# Altium schematic sheet GalvoPrint.SchDoc
size A2
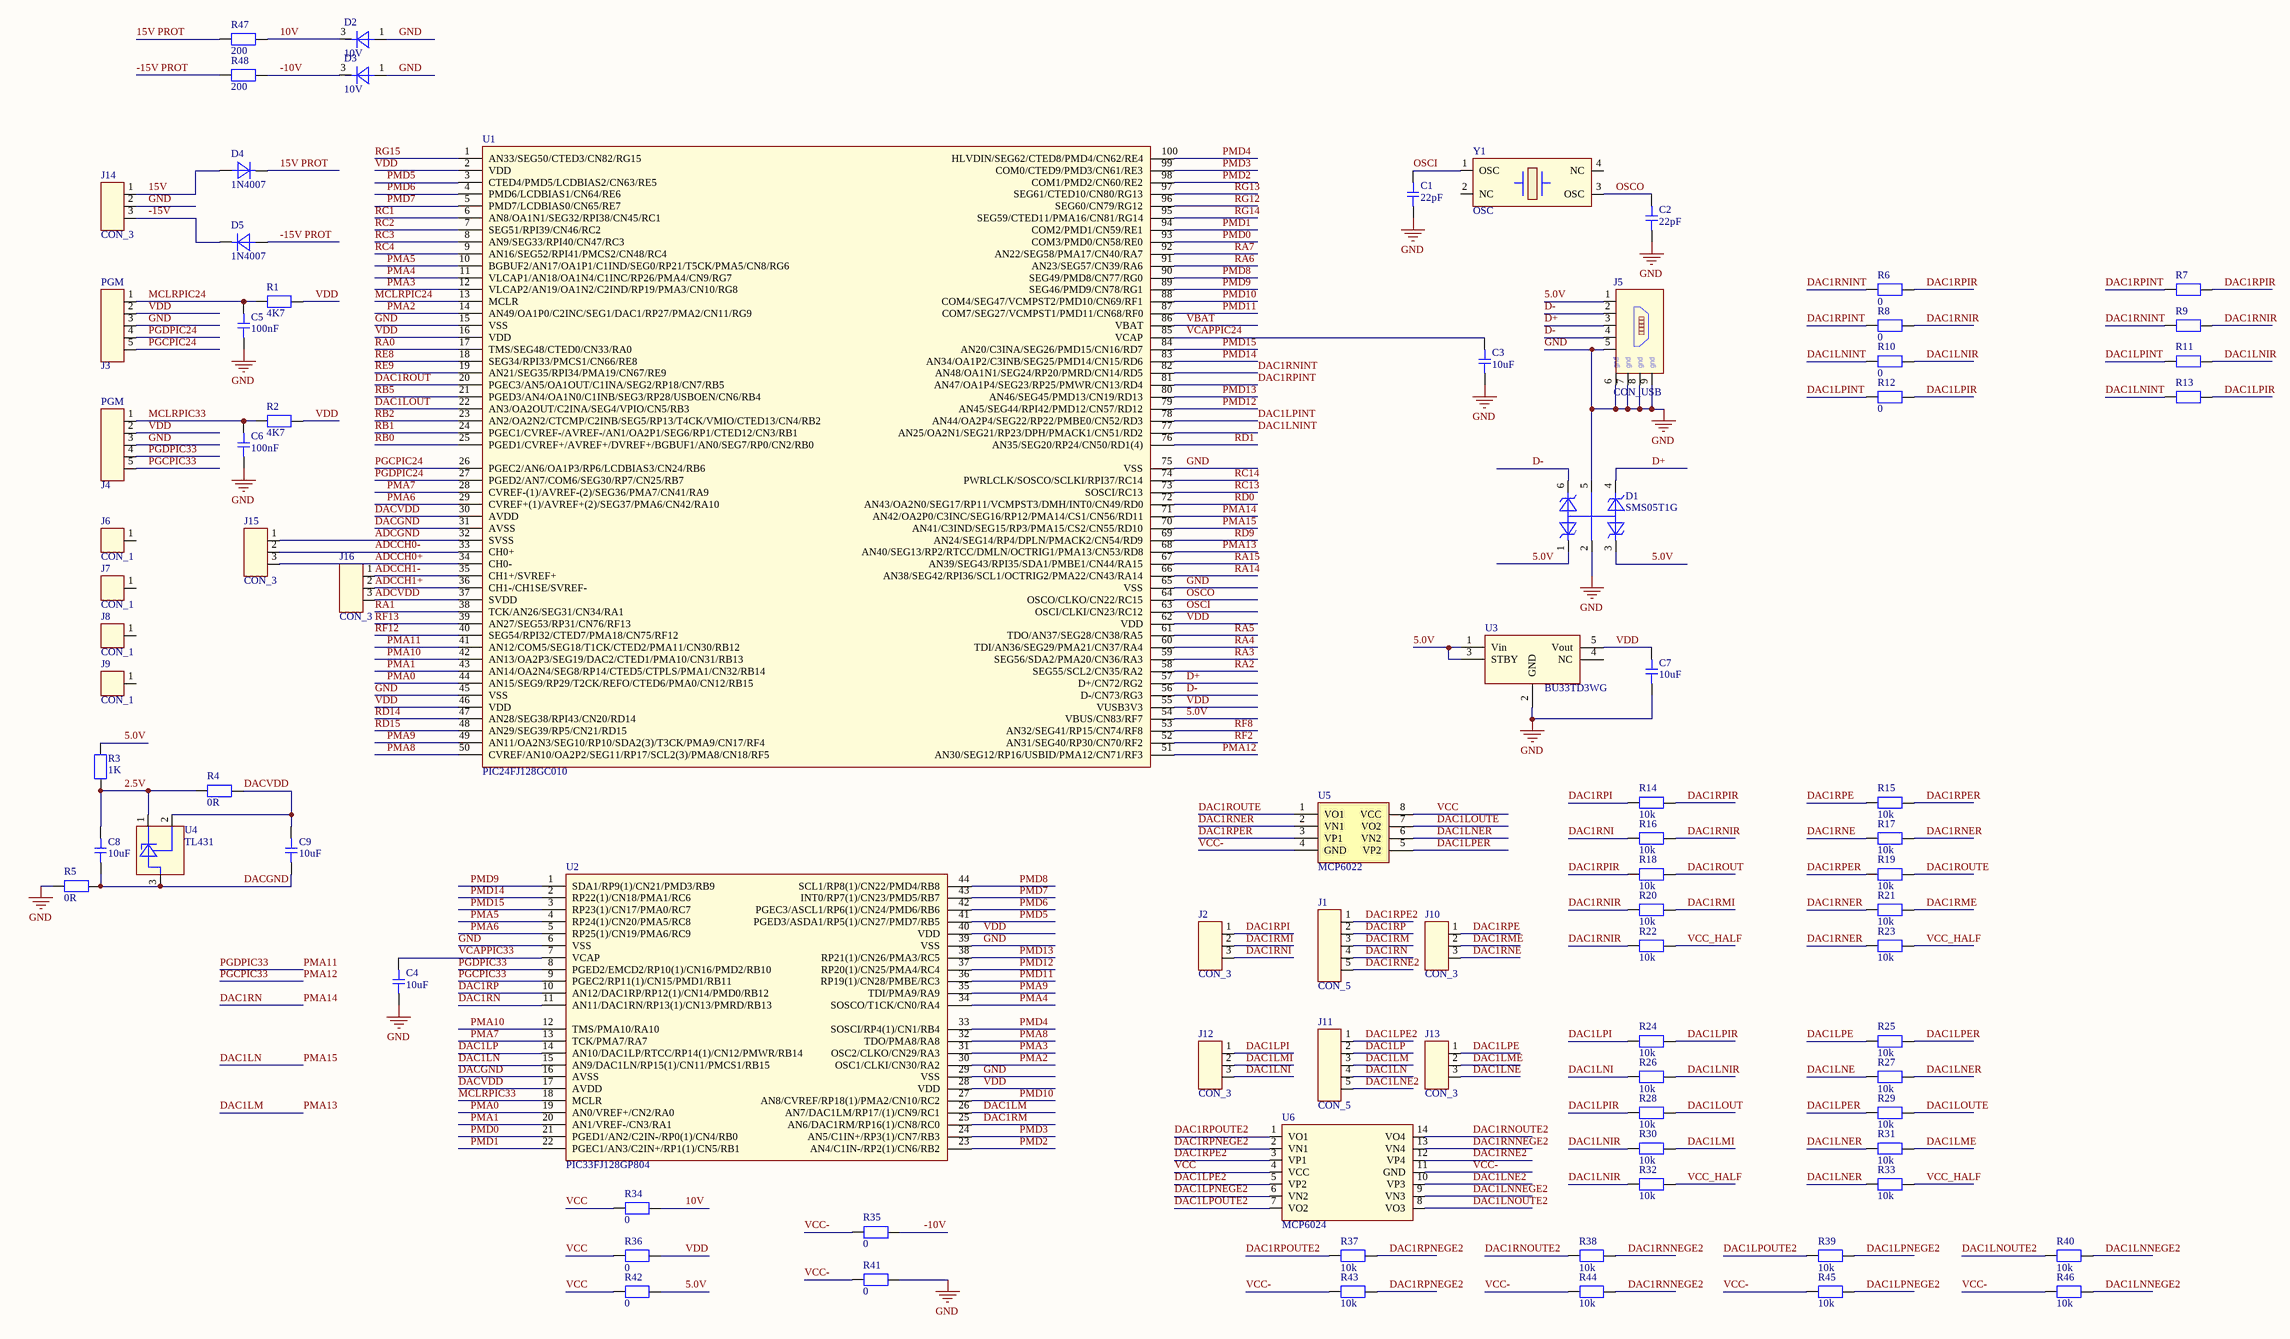
[diagram p0: GalvoPrint.SchDoc]

## Parts
C1  value 22pF  [0603_C]  (hidden comment: C)
C2  value 22pF  [0603_C]  (hidden comment: C)
C3  value 10uF  [0603_C]  (hidden comment: C)
C4  value 10uF  [0603_C]  (hidden comment: C)
C5  value 100nF  [0603_C]  (hidden comment: C)
C6  value 100nF  [0603_C]  (hidden comment: C)
C7  value 10uF  [0603_C]  (hidden comment: C)
C8  value 10uF  [0603_C]  (hidden comment: C)
C9  value 10uF  [0603_C]  (hidden comment: C)
D1  SMS05T1G  [SOT23_6]
D2  10V  [SOT23_3]
D3  10V  [SOT23_3]
D4  1N4007  [SMA]
D5  1N4007  [SMA]
J1  CON_5  [HDR_254_5]
J2  CON_3  [HDR_254_3]
J3  value PGM  [HDR_254_5]  (hidden comment: CON_5)
J4  value PGM  [HDR_254_5]  (hidden comment: CON_5)
J5  CON_USB  [CON_USB_MINI]
J6  CON_1  [MOUNT_HOLE]
J7  CON_1  [MOUNT_HOLE]
J8  CON_1  [MOUNT_HOLE]
J9  CON_1  [MOUNT_HOLE]
J10  CON_3  [HDR_254_3]
J11  CON_5  [HDR_254_5]
J12  CON_3  [HDR_254_3]
J13  CON_3  [HDR_254_3]
J14  CON_3  [HDR_500_3]
J15  CON_3  [HDR_254_3]
J16  CON_3  [HDR_254_3]
R1  value 4K7  [0603_R]  (hidden comment: R)
R2  value 4K7  [0603_R]  (hidden comment: R)
R3  value 1K  [0603_R]  (hidden comment: R)
R4  value 0R  [0603_R]  (hidden comment: R)
R5  value 0R  [0603_R]  (hidden comment: R)
R6  0  [0603_R]
R7  (no value)  [0603_R]
R8  0  [0603_R]
R9  (no value)  [0603_R]
R10  0  [0603_R]
R11  (no value)  [0603_R]
R12  0  [0603_R]
R13  (no value)  [0603_R]
R14  10k  [0603_R]
R15  10k  [0603_R]
R16  10k  [0603_R]
R17  10k  [0603_R]
R18  10k  [0603_R]
R19  10k  [0603_R]
R20  10k  [0603_R]
R21  10k  [0603_R]
R22  10k  [0603_R]
R23  10k  [0603_R]
R24  10k  [0603_R]
R25  10k  [0603_R]
R26  10k  [0603_R]
R27  10k  [0603_R]
R28  10k  [0603_R]
R29  10k  [0603_R]
R30  10k  [0603_R]
R31  10k  [0603_R]
R32  10k  [0603_R]
R33  10k  [0603_R]
R34  0  [0603_R]
R35  0  [0603_R]
R36  0  [0603_R]
R37  10k  [0603_R]
R38  10k  [0603_R]
R39  10k  [0603_R]
R40  10k  [0603_R]
R41  0  [0603_R]
R42  0  [0603_R]
R43  10k  [0603_R]
R44  10k  [0603_R]
R45  10k  [0603_R]
R46  10k  [0603_R]
R47  value 200  [0603_R]  (hidden comment: R)
R48  value 200  [0603_R]  (hidden comment: R)
U1  value PIC24FJ128GC010  [TQFP_100]  (hidden comment: IC_PIC24FJ128GC010)
U2  value PIC33FJ128GP804  [TQFP_44]  (hidden comment: IC_PIC33FJ128GP804)
U3  BU33TD3WG  [SOT23_5]
U4  value TL431  [SOT23_3]  (hidden comment: IC_TL431_SOT23_3)
U5  MCP6022  [SOIC_8]
U6  MCP6024  [SOIC_14]
Y1  value OSC  [OSC_DFN_2x2.5mm]  (hidden comment: XTAL_OSC1OSC3)

## Nets
GND: C1.1 C2.1 C3.1 C4.1 C5.1 C6.1 C7.1 D1.2(AAAA) D1.5(C4) D2.1(A) D3.1(A) J3.3 J4.3 J5.5 J5.6 J5.7 J5.8 J5.9 J14.2 R5.1 R41.2 U1.15(VSS) U1.45(VSS) U1.65(VSS) U1.75(VSS) U2.6(VSS) U2.29(VSS) U2.39(VSS) U3.2(GND)
2.5V: C8.2 R3.1 R4.1 U4.1(Cathode)
5.0V: D1.1(C1) D1.3(C2) J5.1 R3.2 R42.2 U1.54(VBUS/CN83/RF7) U3.1(Vin) U3.3(STBY)
10V: D2.3(C) R34.2 R47.2
15V: D4.2(A) J14.1
15V PROT: D4.1(C) R47.1
-10V: D3.3(C) R35.2 R48.2
-15V: D5.1(C) J14.3
-15V PROT: D5.2(A) R48.1
ADCCH0+: J15.3 U1.34(CH0-)
ADCCH0-: J15.2 U1.33(CH0+)
ADCCH1+: J16.2 U1.36(CH1-/CH1SE/SVREF-)
ADCCH1-: J16.1 U1.35(CH1+/SVREF+)
ADCGND: J15.1 U1.32(SVSS)
ADCVDD: J16.3 U1.37(SVDD)
D+: D1.4(C3) J5.3 U1.57(D+/CN72/RG2)
D-: D1.6(C4) J5.2 J5.4 U1.56(D-/CN73/RG3)
DAC1LM: J11.3 U1.68(AN40/SEG13/RP2/RTCC/DMLN/OCTRIG1/PMA13/CN53/RD8) U2.26(AN7/DAC1LM/RP17/(1)/CN9/RC1)  [also labelled PMA13]
DAC1LME: J13.2 R31.2
DAC1LMI: J12.2 R30.2
DAC1LN: J11.4 U1.70(AN41/C3IND/SEG15/RP3/PMA15/CS2/CN55/RD10) U2.15(AN9/DAC1LN/RP15(1)/CN11/PMCS1/RB15)  [also labelled PMA15]
DAC1LNE: J13.3 R27.1
DAC1LNE2: J11.5 U6.10(VP3)
DAC1LNER: R27.2 R31.1 R33.1 U5.6(VN2)
DAC1LNI: J12.3 R26.1
DAC1LNINT: R10.1 R13.1 U1.77(AN25/OA2N1/SEG21/RP23/DPH/PMACK1/CN51/RD2)
DAC1LNIR: R10.2 R11.2 R26.2 R30.1 R32.1
DAC1LNNEGE2: R40.2 R46.2 U6.9(VN3)
DAC1LNOUTE2: R40.1 U6.8(VO3)
DAC1LOUT: R28.2 U1.22(AN3/OA2OUT/C2INA/SEG4/VPIO/CN5/RB3)
DAC1LOUTE: R29.2 U5.7(VO2)
DAC1LP: J11.2 U2.14(AN10/DAC1LP/RTCC/RP14(1)/CN12/PMWR/RB14)
DAC1LPE: J13.1 R25.1
DAC1LPE2: J11.1 U6.5(VP2)
DAC1LPER: R25.2 R29.1 U5.5(VP2)
DAC1LPI: J12.1 R24.1
DAC1LPINT: R11.1 R12.1 U1.78(AN44/OA2P4/SEG22/RP22/PMBE0/CN52/RD3)
DAC1LPIR: R12.2 R13.2 R24.2 R28.1
DAC1LPNEGE2: R39.2 R45.2 U6.6(VN2)
DAC1LPOUTE2: R39.1 U6.7(VO2)
DAC1RM: J1.3 U2.25(AN6/DAC1RM/RP16(1)/CN8/RC0)
DAC1RME: J10.2 R21.2
DAC1RMI: J2.2 R20.2
DAC1RN: J1.4 U1.71(AN42/OA2P0/C3INC/SEG16/RP12/PMA14/CS1/CN56/RD11) U2.11(AN11/DAC1RN/RP13(1)/CN13/PMRD/RB13)  [also labelled PMA14]
DAC1RNE: J10.3 R17.1
DAC1RNE2: J1.5 U6.12(VP4)
DAC1RNER: R17.2 R21.1 R23.1 U5.2(VN1)
DAC1RNI: J2.3 R16.1
DAC1RNINT: R6.1 R9.1 U1.82(AN48/OA1N1/SEG24/RP20/PMRD/CN14/RD5)
DAC1RNIR: R8.2 R9.2 R16.2 R20.1 R22.1
DAC1RNNEGE2: R38.2 R44.2 U6.13(VN4)
DAC1RNOUTE2: R38.1 U6.14(VO4)
DAC1ROUT: R18.2 U1.20(PGEC3/AN5/OA1OUT/C1INA/SEG2/RP18/CN7/RB5)
DAC1ROUTE: R19.2 U5.1(VO1)
DAC1RP: J1.2 U2.10(AN12/DAC1RP/RP12(1)/CN14/PMD0/RB12)
DAC1RPE: J10.1 R15.1
DAC1RPE2: J1.1 U6.3(VP1)
DAC1RPER: R15.2 R19.1 U5.3(VP1)
DAC1RPI: J2.1 R14.1
DAC1RPINT: R7.1 R8.1 U1.81(AN47/OA1P4/SEG23/RP25/PMWR/CN13/RD4)
DAC1RPIR: R6.2 R7.2 R14.2 R18.1
DAC1RPNEGE2: R37.2 R43.2 U6.2(VN1)
DAC1RPOUTE2: R37.1 U6.1(VO1)
DACGND: C8.1 C9.1 R5.2 U1.31(AVSS) U2.16(AVSS) U4.3(Anode)
DACVDD: C9.2 R4.2 U1.30(AVDD) U2.17(AVDD) U4.2(Ref)
MCLRPIC24: C5.2 J3.1 R1.1 U1.13(MCLR)
MCLRPIC33: C6.2 J4.1 R2.1 U2.18(MCLR)
OSCI: C1.2 U1.63(OSCI/CLKI/CN23/RC12) Y1.1(OSC)
OSCO: C2.2 U1.64(OSCO/CLKO/CN22/RC15) Y1.3(OSC)
PGCPIC24: J3.5 U1.26(PGEC2/AN6/OA1P3/RP6/LCDBIAS3/CN24/RB6)
PGCPIC33: J4.5 U1.51(AN30/SEG12/RP16/USBID/PMA12/CN71/RF3) U2.9(PGEC2/RP11(1)/CN15/PMD1/RB11)  [also labelled PMA12]
PGDPIC24: J3.4 U1.27(PGED2/AN7/COM6/SEG30/RP7/CN25/RB7)
PGDPIC33: J4.4 U1.41(AN12/COM5/SEG18/T1CK/CTED2/PMA11/CN30/RB12) U2.8(PGED2/EMCD2/RP10(1)/CN16/PMD2/RB10)  [also labelled PMA11]
PMA0: U1.44(AN15/SEG9/RP29/T2CK/REFO/CTED6/PMA0/CN12/RB15) U2.19(AN0/VREF+/CN2/RA0)
PMA1: U1.43(AN14/OA2N4/SEG8/RP14/CTED5/CTPLS/PMA1/CN32/RB14) U2.20(AN1/VREF-/CN3/RA1)
PMA2: U1.14(AN49/OA1P0/C2INC/SEG1/DAC1/RP27/PMA2/CN11/RG9) U2.30(OSC1/CLKI/CN30/RA2)
PMA3: U1.12(VLCAP2/AN19/OA1N2/C2IND/RP19/PMA3/CN10/RG8) U2.31(OSC2/CLKO/CN29/RA3)
PMA4: U1.11(VLCAP1/AN18/OA1N4/C1INC/RP26/PMA4/CN9/RG7) U2.34(SOSCO/T1CK/CN0/RA4)
PMA5: U1.10(BGBUF2/AN17/OA1P1/C1IND/SEG0/RP21/T5CK/PMA5/CN8/RG6) U2.4(RP24(1)/CN20/PMA5/RC8)
PMA6: U1.29(CVREF+(1)/AVREF+(2)/SEG37/PMA6/CN42/RA10) U2.5(RP25(1)/CN19/PMA6/RC9)
PMA7: U1.28(CVREF-(1)/AVREF-(2)/SEG36/PMA7/CN41/RA9) U2.13(TCK/PMA7/RA7)
PMA8: U1.50(CVREF/AN10/OA2P2/SEG11/RP17/SCL2(3)/PMA8/CN18/RF5) U2.32(TDO/PMA8/RA8)
PMA9: U1.49(AN11/OA2N3/SEG10/RP10/SDA2(3)/T3CK/PMA9/CN17/RF4) U2.35(TDI/PMA9/RA9)
PMA10: U1.42(AN13/OA2P3/SEG19/DAC2/CTED1/PMA10/CN31/RB13) U2.12(TMS/PMA10/RA10)
PMD0: U1.93(COM3/PMD0/CN58/RE0) U2.21(PGED1/AN2/C2IN-/RP0(1)/CN4/RB0)
PMD1: U1.94(COM2/PMD1/CN59/RE1) U2.22(PGEC1/AN3/C2IN+/RP1(1)/CN5/RB1)
PMD2: U1.98(COM1/PMD2/CN60/RE2) U2.23(AN4/C1IN-/RP2(1)/CN6/RB2)
PMD3: U1.99(COM0/CTED9/PMD3/CN61/RE3) U2.24(AN5/C1IN+/RP3(1)/CN7/RB3)
PMD4: U1.100(HLVDIN/SEG62/CTED8/PMD4/CN62/RE4) U2.33(SOSCI/RP4(1)/CN1/RB4)
PMD5: U1.3(CTED4/PMD5/LCDBIAS2/CN63/RE5) U2.41(PGED3/ASDA1/RP5(1)/CN27/PMD7/RB5)
PMD6: U1.4(PMD6/LCDBIAS1/CN64/RE6) U2.42(PGEC3/ASCL1/RP6(1)/CN24/PMD6/RB6)
PMD7: U1.5(PMD7/LCDBIAS0/CN65/RE7) U2.43(INT0/RP7(1)/CN23/PMD5/RB7)
PMD8: U1.90(SEG49/PMD8/CN77/RG0) U2.44(SCL1/RP8(1)/CN22/PMD4/RB8)
PMD9: U1.89(SEG46/PMD9/CN78/RG1) U2.1(SDA1/RP9(1)/CN21/PMD3/RB9)
PMD10: U1.88(COM4/SEG47/VCMPST2/PMD10/CN69/RF1) U2.27(AN8/CVREF/RP18(1)/PMA2/CN10/RC2)
PMD11: U1.87(COM7/SEG27/VCMPST1/PMD11/CN68/RF0) U2.36(RP19(1)/CN28/PMBE/RC3)
PMD12: U1.79(AN45/SEG44/RPI42/PMD12/CN57/RD12) U2.37(RP20(1)/CN25/PMA4/RC4)
PMD13: U1.80(AN46/SEG45/PMD13/CN19/RD13) U2.38(RP21(1)/CN26/PMA3/RC5)
PMD14: U1.83(AN34/OA1P2/C3INB/SEG25/PMD14/CN15/RD6) U2.2(RP22(1)/CN18/PMA1/RC6)
PMD15: U1.84(AN20/C3INA/SEG26/PMD15/CN16/RD7) U2.3(RP23(1)/CN17/PMA0/RC7)
RA0: U1.17(TMS/SEG48/CTED0/CN33/RA0)
RA1: U1.38(TCK/AN26/SEG31/CN34/RA1)
RA2: U1.58(SEG55/SCL2/CN35/RA2)
RA3: U1.59(SEG56/SDA2/PMA20/CN36/RA3)
RA4: U1.60(TDI/AN36/SEG29/PMA21/CN37/RA4)
RA5: U1.61(TDO/AN37/SEG28/CN38/RA5)
RA6: U1.91(AN23/SEG57/CN39/RA6)
RA7: U1.92(AN22/SEG58/PMA17/CN40/RA7)
RA14: U1.66(AN38/SEG42/RPI36/SCL1/OCTRIG2/PMA22/CN43/RA14)
RA15: U1.67(AN39/SEG43/RPI35/SDA1/PMBE1/CN44/RA15)
RB0: U1.25(PGED1/CVREF+/AVREF+/DVREF+/BGBUF1/AN0/SEG7/RP0/CN2/RB0)
RB1: U1.24(PGEC1/CVREF-/AVREF-/AN1/OA2P1/SEG6/RP1/CTED12/CN3/RB1)
RB2: U1.23(AN2/OA2N2/CTCMP/C2INB/SEG5/RP13/T4CK/VMIO/CTED13/CN4/RB2)
RB5: U1.21(PGED3/AN4/OA1N0/C1INB/SEG3/RP28/USBOEN/CN6/RB4)
RC1: U1.6(AN8/OA1N1/SEG32/RPI38/CN45/RC1)
RC2: U1.7(SEG51/RPI39/CN46/RC2)
RC3: U1.8(AN9/SEG33/RPI40/CN47/RC3)
RC4: U1.9(AN16/SEG52/RPI41/PMCS2/CN48/RC4)
RC13: U1.73(SOSCI/RC13)
RC14: U1.74(PWRLCLK/SOSCO/SCLKI/RPI37/RC14)
RD0: U1.72(AN43/OA2N0/SEG17/RP11/VCMPST3/DMH/INT0/CN49/RD0)
RD1: U1.76(AN35/SEG20/RP24/CN50/RD1(4))
RD9: U1.69(AN24/SEG14/RP4/DPLN/PMACK2/CN54/RD9)
RD14: U1.47(AN28/SEG38/RPI43/CN20/RD14)
RD15: U1.48(AN29/SEG39/RP5/CN21/RD15)
RE8: U1.18(SEG34/RPI33/PMCS1/CN66/RE8)
RE9: U1.19(AN21/SEG35/RPI34/PMA19/CN67/RE9)
RF2: U1.52(AN31/SEG40/RP30/CN70/RF2)
RF8: U1.53(AN32/SEG41/RP15/CN74/RF8)
RF12: U1.40(SEG54/RPI32/CTED7/PMA18/CN75/RF12)
RF13: U1.39(AN27/SEG53/RP31/CN76/RF13)
RG12: U1.96(SEG60/CN79/RG12)
RG13: U1.97(SEG61/CTED10/CN80/RG13)
RG14: U1.95(SEG59/CTED11/PMA16/CN81/RG14)
RG15: U1.1(AN33/SEG50/CTED3/CN82/RG15)
VBAT: U1.86(VBAT)
VCAPPIC24: C3.2 U1.85(VCAP)
VCAPPIC33: C4.2 U2.7(VCAP)
VCC: R34.1 R36.1 R42.1 U5.8(VCC) U6.4(VCC)
VCC-: R35.1 R41.1 R43.1 R44.1 R45.1 R46.1 U5.4(GND) U6.11(GND)
VCC_HALF: R22.2 R23.2 R32.2 R33.2
VDD: C7.2 J3.2 J4.2 R1.2 R2.2 R36.2 U1.2(VDD) U1.16(VDD) U1.46(VDD) U1.55(VUSB3V3) U1.62(VDD) U2.28(VDD) U2.40(VDD) U3.5(Vout)

Not connected (* = marked no-connect by the designer): J6 1; J7 1; J8 1; J9 1; U3 4(NC); Y1 2(NC) 4(NC)

## Notes on the sheet
- (in symbol CON_USB) gnd

## Library data of the parts
C1-C9 = C: Capacitor; Published: 8-Jun-2000; LatestRevisionDate: 17-Jul-2002; LatestRevisionNote: Re-released for DXP Platform.; PackageReference: RAD-0.3; Publisher: Altium Limited; PackageDescription: Radial Cap, Thru-Hole; 2 Leads; 0.3 in Pin Spacing
D1 = D_TVS_QUAD_C1AA2AA5C3C4C6: TVS like SMS05T1G; Value: SMS05T1G
D2 D3 = D_A1C3: Diodes like 1N4148; Value: 10V
D4 D5 = D: Diode; Value: 1N4007
J1 J3 J4 J11 = CON_5: Header 5 Pins
  J1 J11: Value: CON_5
J2 J10 J12-J16 = CON_3: Header 3 Pins; Value: CON_3
J6-J9 = CON_1: Mounting Hole; Value: CON_1
R1-R48 = R: Resistor; Published: 8-Jun-2000; LatestRevisionDate: 17-Jul-2002; LatestRevisionNote: Re-released for DXP Platform.; PackageReference: AXIAL-0.3; Publisher: Altium Limited; PackageDescription: Axial Device, Thru-Hole; 2 Leads; 0.3 in Pin Spacing
  R6 R8 R10 R12 R34-R36 R41 R42: Value: 0
  R14-R33 R37-R40 R43-R46: Value: 10k
U3 = IC_BU33TD3WG: LDO 5 to 3.3V; Value: BU33TD3WG
U5 = IC_MCP6022: Opamp x 2; Value: MCP6022
U6 = IC_MCP6024: Opamp x 4; Value: MCP6024
J5 = CON_USB: Value: CON_USB